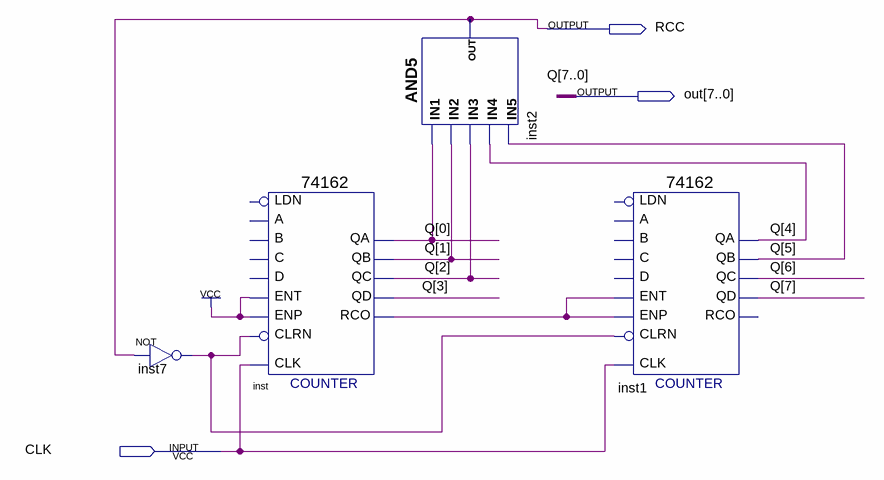
[diagram p0: schematic sheet]
// Quartus schematic 38Counter.bdf as structural Verilog: 4 symbols, 3 pins
module \38Counter  (
  input  CLK,
  output RCC,
  output [7:0] out
);

  wire inst7_out, inst_rco;

  not inst7 (inst7_out, RCC);
  \74162  inst (
    .ENP(1'b1), .ENT(1'b1), .CLRN(inst7_out), .CLK(CLK), .QA(out[0]), .QB(out[1]), .QC(out[2]), .QD(out[3]),
    .RCO(inst_rco));  // open: A, LDN, B, C, D
  and inst2 (RCC, out[0], out[1], out[2], out[4], out[5]);
  \74162  inst1 (
    .ENP(inst_rco), .ENT(inst_rco), .CLRN(inst7_out), .CLK(CLK), .QA(out[4]), .QB(out[5]), .QC(out[6]),
    .QD(out[7]));  // open: A, LDN, B, C, D, RCO

  // Other names for the same wires on the sheet: Q[7:0] = out
endmodule
